# Altium schematic sheet DDR2.SchDoc: {Наименование}
size 420 x 297 mm; DocumentNumber: ПЛАС.ХХХХХХ.ХХХ ХХ; SheetNumber: 11; SheetTotal: 11; PageSetup: Record=PageOptions|CenterHorizontal=False|CenterVertical=False|PrintScale=0.95|XCorrection=0.00|YCorrection=0.00|PrintKind=1|BorderSize=5000000|LeftOffset=0|BottomOffset=0|Orientation=1|PaperLength=1000|PaperWidth=1000|Scale=100|PaperSource=15|PrintQuality=600|MediaType=1|DitherType=10|PaperKind=A4|PrintScaleMode=1; Rule: PcbType=ProtelPcb
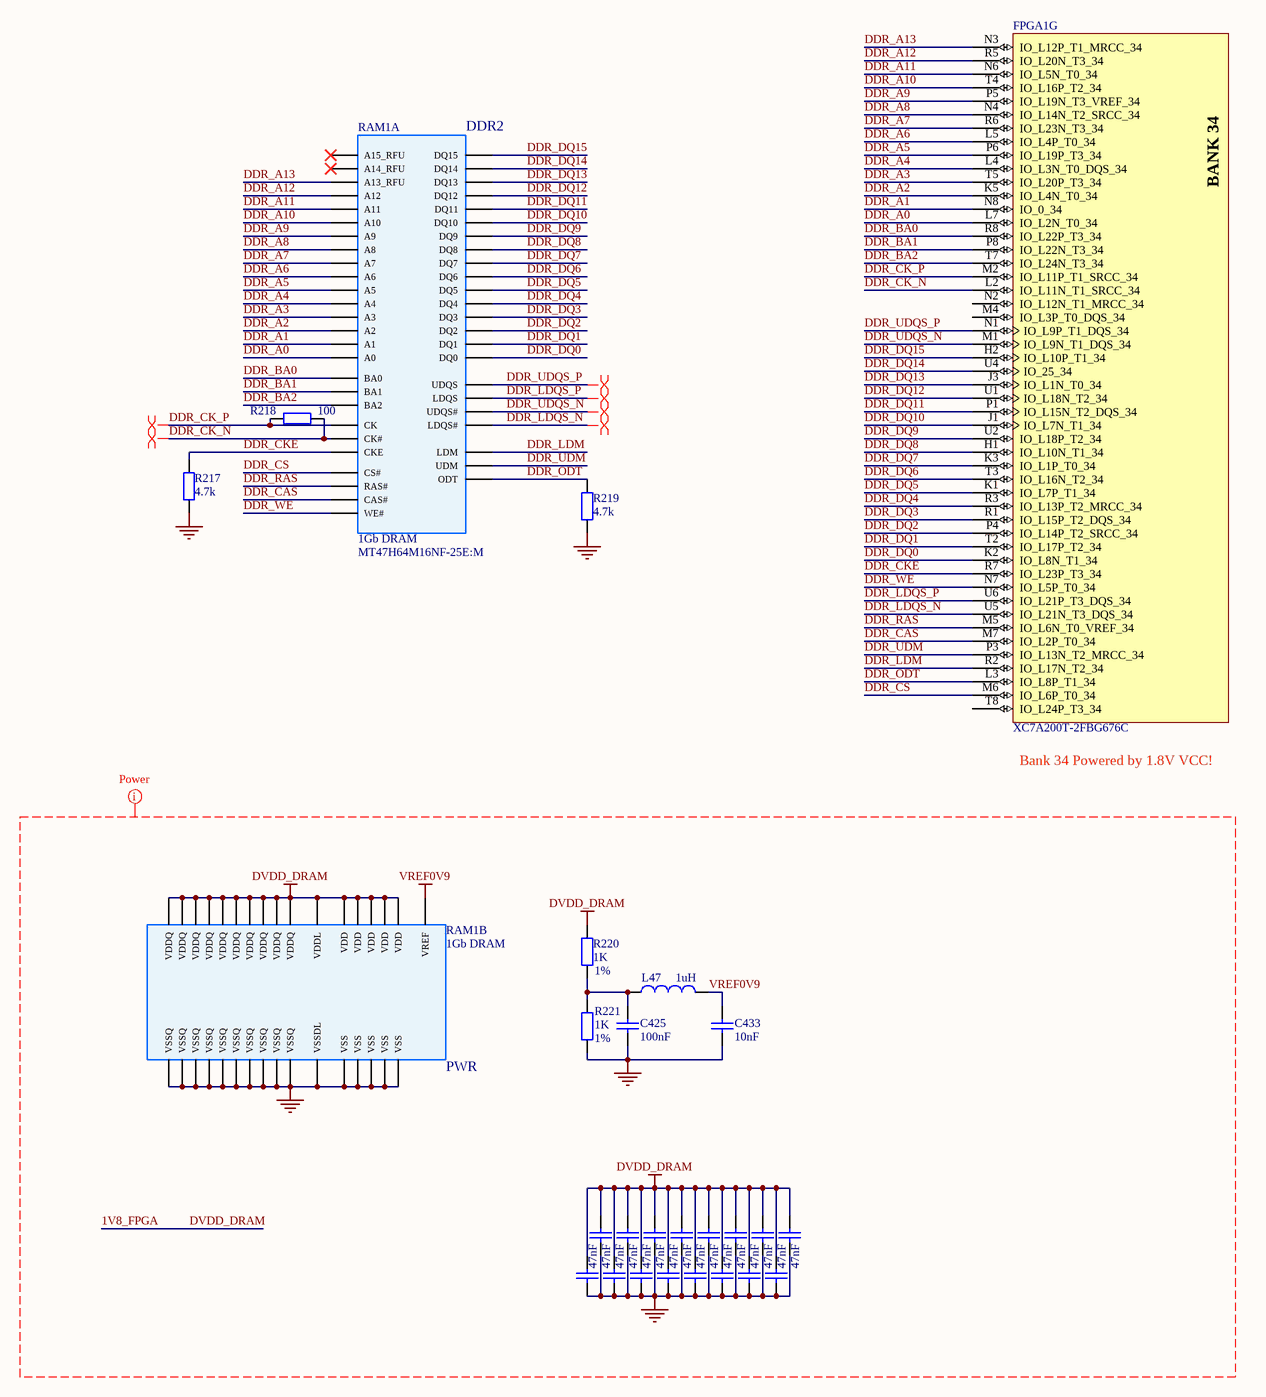
[diagram p0: DDR2.SchDoc]

## Parts
C422  value 47nF  [С0402]  (hidden comment: Cap)
C423  value 47nF  [С0402]  (hidden comment: Cap)
C424  value 47nF  [С0402]  (hidden comment: Cap)
C425  value 100nF  [С0402]  (hidden comment: Cap)
C426  value 47nF  [С0402]  (hidden comment: Cap)
C427  value 47nF  [С0402]  (hidden comment: Cap)
C428  value 47nF  [С0402]  (hidden comment: Cap)
C429  value 47nF  [С0402]  (hidden comment: Cap)
C430  value 47nF  [С0402]  (hidden comment: Cap)
C431  value 47nF  [С0402]  (hidden comment: Cap)
C432  value 47nF  [С0402]  (hidden comment: Cap)
C433  value 10nF  [С0402]  (hidden comment: Cap)
C434  value 47nF  [С0402]  (hidden comment: Cap)
C435  value 47nF  [С0402]  (hidden comment: Cap)
C436  value 47nF  [С0402]  (hidden comment: Cap)
C437  value 47nF  [С0402]  (hidden comment: Cap)
C438  value 47nF  [С0402]  (hidden comment: Cap)
C439  value 47nF  [С0402]  (hidden comment: Cap)
FPGA1  XC7A200T-2FBG676C  [FGG676]  (part G of 14)
L47  value 1uH  [L1206_Murata]  (hidden comment: Inductor_LF)
R217  value 4.7k  [R0402]  (hidden comment: Res)
R218  value 100  [R0402]  (hidden comment: Res)
R219  value 4.7k  [R0402]  (hidden comment: Res)
R220  value 1K  Tolerance: 1%  [R0402]  (hidden comment: Res)
R221  value 1K  Tolerance: 1%  [R0402]  (hidden comment: Res)
RAM1  1Gb DRAM  Name: MT47H64M16NF-25E:M  [BGA84]  (parts A,B of 2)

## Nets
1V8_FPGA: C422.2 C423.1 C424.2 C426.2 C427.2 C428.1 C429.1 C430.1 C431.2 C432.2 C434.2 C435.1 C436.2 C437.2 C438.2 C439.1 R220.2 RAM1.A1(VDD) RAM1.A9(VDDQ) RAM1.C1(VDDQ) RAM1.C3(VDDQ) RAM1.C7(VDDQ) RAM1.C9(VDDQ) RAM1.E1(VDD) RAM1.E9(VDDQ) RAM1.G1(VDDQ) RAM1.G3(VDDQ) RAM1.G7(VDDQ) RAM1.G9(VDDQ) RAM1.J1(VDDL) RAM1.J9(VDD) RAM1.M9(VDD) RAM1.R1(VDD)  [also labelled DVDD_DRAM]
GND: C422.1 C423.2 C424.1 C425.2 C426.1 C427.1 C428.2 C429.2 C430.2 C431.1 C432.1 C433.1 C434.1 C435.2 C436.1 C437.1 C438.1 C439.2 R217.1 R219.1 R221.2 RAM1.A3(VSS) RAM1.A7(VSSQ) RAM1.B2(VSSQ) RAM1.B8(VSSQ) RAM1.D2(VSSQ) RAM1.D8(VSSQ) RAM1.E3(VSS) RAM1.E7(VSSQ) RAM1.F2(VSSQ) RAM1.F8(VSSQ) RAM1.H2(VSSQ) RAM1.H8(VSSQ) RAM1.J3(VSS) RAM1.J7(VSSDL) RAM1.N1(VSS) RAM1.P9(VSS)
VREF0V9: C433.2 L47.1 RAM1.J2(VREF)
DDR_A0: FPGA1.L7(IO_L2N_T0_34) RAM1.M8(A0)
DDR_A1: FPGA1.N8(IO_0_34) RAM1.M3(A1)
DDR_A2: FPGA1.K5(IO_L4N_T0_34) RAM1.M7(A2)
DDR_A3: FPGA1.T5(IO_L20P_T3_34) RAM1.N2(A3)
DDR_A4: FPGA1.L4(IO_L3N_T0_DQS_34) RAM1.N8(A4)
DDR_A5: FPGA1.P6(IO_L19P_T3_34) RAM1.N3(A5)
DDR_A6: FPGA1.L5(IO_L4P_T0_34) RAM1.N7(A6)
DDR_A7: FPGA1.R6(IO_L23N_T3_34) RAM1.P2(A7)
DDR_A8: FPGA1.N4(IO_L14N_T2_SRCC_34) RAM1.P8(A8)
DDR_A9: FPGA1.P5(IO_L19N_T3_VREF_34) RAM1.P3(A9)
DDR_A10: FPGA1.T4(IO_L16P_T2_34) RAM1.M2(A10)
DDR_A11: FPGA1.N6(IO_L5N_T0_34) RAM1.P7(A11)
DDR_A12: FPGA1.R5(IO_L20N_T3_34) RAM1.R2(A12)
DDR_A13: FPGA1.N3(IO_L12P_T1_MRCC_34) RAM1.R8(A13_RFU)
DDR_BA0: FPGA1.R8(IO_L22P_T3_34) RAM1.L2(BA0)
DDR_BA1: FPGA1.P8(IO_L22N_T3_34) RAM1.L3(BA1)
DDR_BA2: FPGA1.T7(IO_L24N_T3_34) RAM1.L1(BA2)
DDR_CAS: FPGA1.M7(IO_L2P_T0_34) RAM1.L7(CAS#)
DDR_CK_N: FPGA1.L2(IO_L11N_T1_SRCC_34) R218.2 RAM1.K8(CK#)
DDR_CK_P: FPGA1.M2(IO_L11P_T1_SRCC_34) R218.1 RAM1.J8(CK)
DDR_CKE: FPGA1.R7(IO_L23P_T3_34) R217.2 RAM1.K2(CKE)
DDR_CS: FPGA1.M6(IO_L6P_T0_34) RAM1.L8(CS#)
DDR_DQ0: FPGA1.K2(IO_L8N_T1_34) RAM1.G8(DQ0)
DDR_DQ1: FPGA1.T2(IO_L17P_T2_34) RAM1.G2(DQ1)
DDR_DQ2: FPGA1.P4(IO_L14P_T2_SRCC_34) RAM1.H7(DQ2)
DDR_DQ3: FPGA1.R1(IO_L15P_T2_DQS_34) RAM1.H3(DQ3)
DDR_DQ4: FPGA1.R3(IO_L13P_T2_MRCC_34) RAM1.H1(DQ4)
DDR_DQ5: FPGA1.K1(IO_L7P_T1_34) RAM1.H9(DQ5)
DDR_DQ6: FPGA1.T3(IO_L16N_T2_34) RAM1.F1(DQ6)
DDR_DQ7: FPGA1.K3(IO_L1P_T0_34) RAM1.F9(DQ7)
DDR_DQ8: FPGA1.H1(IO_L10N_T1_34) RAM1.C8(DQ8)
DDR_DQ9: FPGA1.U2(IO_L18P_T2_34) RAM1.C2(DQ9)
DDR_DQ10: FPGA1.J1(IO_L7N_T1_34) RAM1.D7(DQ10)
DDR_DQ11: FPGA1.P1(IO_L15N_T2_DQS_34) RAM1.D3(DQ11)
DDR_DQ12: FPGA1.U1(IO_L18N_T2_34) RAM1.D1(DQ12)
DDR_DQ13: FPGA1.J3(IO_L1N_T0_34) RAM1.D9(DQ13)
DDR_DQ14: FPGA1.U4(IO_25_34) RAM1.B1(DQ14)
DDR_DQ15: FPGA1.H2(IO_L10P_T1_34) RAM1.B9(DQ15)
DDR_LDM: FPGA1.R2(IO_L17N_T2_34) RAM1.F3(LDM)
DDR_LDQS_N: FPGA1.U5(IO_L21N_T3_DQS_34) RAM1.E8(LDQS#)
DDR_LDQS_P: FPGA1.U6(IO_L21P_T3_DQS_34) RAM1.F7(LDQS)
DDR_ODT: FPGA1.L3(IO_L8P_T1_34) R219.2 RAM1.K9(ODT)
DDR_RAS: FPGA1.M5(IO_L6N_T0_VREF_34) RAM1.K7(RAS#)
DDR_UDM: FPGA1.P3(IO_L13N_T2_MRCC_34) RAM1.B3(UDM)
DDR_UDQS_N: FPGA1.M1(IO_L9N_T1_DQS_34) RAM1.A8(UDQS#)
DDR_UDQS_P: FPGA1.N1(IO_L9P_T1_DQS_34) RAM1.B7(UDQS)
DDR_WE: FPGA1.N7(IO_L5P_T0_34) RAM1.K3(WE#)
NetC425_1: C425.1 L47.2 R220.1 R221.1

Not connected (* = marked no-connect by the designer): FPGA1 M4(IO_L3P_T0_DQS_34) N2(IO_L12N_T1_MRCC_34) T8(IO_L24P_T3_34); RAM1 R3(A14_RFU)* R7(A15_RFU)*

## Layout directives
net class Power: 1V8_FPGA, DVDD_DRAM, GND, VREF0V9
differential pair: DDR_CK_N, DDR_CK_P, DDR_LDQS_N, DDR_LDQS_P, DDR_UDQS_N, DDR_UDQS_P

## Notes on the sheet
- (near FPGA1) Bank 34 Powered by 1.8V VCC!
- Подп. и дата
- Инв. № дубл.
- Взам. инв. №
- Инв. № подл.
- Лист
- Изм.
- № докум.
- Подп.
- Дата
- Копировал
- Формат А3
- (in symbol MT47H64M16, part A) DDR2
- (in symbol MT47H64M16, part B) PWR
- (in symbol XC7A200T-2FBG676C, part G) BANK 34

## Library data of the parts
C422-C439 = Cer Cap: Cer Cap Small; Manufacturer: Murata; Material: x7r; Voltage: 50V; Tolerance: 10%; Type: Ceramic; PackageReference: SMD Chip Capacitor; Package: 0402
FPGA1 = XC7A200T-2FBG676C: Artix-7 FPGA, 400 User I/Os, 8 GTP, 676-Ball BGA, Speed Grade 2, Commercial Grade, Pb-Free; Manufacturer: Xilinx; Block RAM Blocks (18Kb): 730; Block RAM Blocks (36Kb): 365; Block RAM Blocks (Max Kb): 13140; CLBs (Slices): 33650; Clock Mgmt Tiles (CMTs): 10; DSP48E1 Slices: 740; Logic Cells: 215360; Max User I/O: 500; Speed Grade: -2; DatasheetVersion: v1.12; PackageVersion: Rev 1.8; PackageReference: FBG676; PackageDescription: Flip-Chip Lidless BGA, Body 27 x 27 mm, 1.0 mm Pitch; Supplier 1: Digi-Key; Supplier Part Number 1: 122-1865-ND; CLBs (Max Distributed RAM Kb): 2888; Generic Part Number: XC7A200T; RoHS: Pb-Free; NexusDeviceID: XC7A200T-2FBG676C; Mounting Technology: Surface Mount; Code_JEDEC: MS-034; PartNumber: XC7A200T-2FBG676C; ComponentLink1Description: Manufacturer URL; ComponentLink1URL: http://www.xilinx.com/; ComponentLink2Description: Datasheet; ComponentLink2URL: http://www.xilinx.com/support/documentation/data_sheets/ds180_7Series_Overview.pdf; ComponentLink3Description: Package Specification; ComponentLink3URL: http://www.xilinx.com/support/documentation/user_guides/ug475_7Series_Pkg_Pinout.pdf; ComponentLink4Description: DC and Switching Characteristics; ComponentLink4URL: http://www.xilinx.com/support/documentation/data_sheets/ds181_Artix_7_Data_Sheet.pdf; ComponentLink5Description: Package File; ComponentLink5URL: http://www.xilinx.com/support/packagefiles/a7packages/xc7a200tfbg676pkg.txt; ComponentLink6Description: Packaging and Pinout; ComponentLink6URL: http://www.xilinx.com/support/documentation/user_guides/ug475_7Series_Pkg_Pinout.pdf
L47 = Inductor_LF: Inductor_Power_Lines; Manufacturer: Murata; Name: LQM31PN1R0M00; Tolerance: 5%; Current: 1200mA; Frequency: 60MHz; Package: 1206; PackageDescription: Chip Inductor; Temperature Range: -25…85; Series: LQM
R217-R219 = Res: Resistor; Name: Chip SMD Resistor; Tolerance: 5%; Power: 0.062 Wt; Package: SMD; Temperature Range: -55…155
R220 R221 = Res: Resistor; Name: Chip SMD Resistor; Power: 0.062 Wt; Package: SMD; Temperature Range: -55…155
RAM1 = MT47H64M16: DDR2 1Gb DRAM; Manufacturer: Micron Technology Inc.; Configuration: 64 Meg x 16 (8 Meg x 16 x 8 banks); Voltage: V  DD  = 1.8V ±0.1V, V  DDQ  = 1.8V ±0.1V; Package: 84-ball FBGA (8mm x 12.5mm)